# EAGLE schematic MAIN BOARD fat outline (EAGLE 5.11)
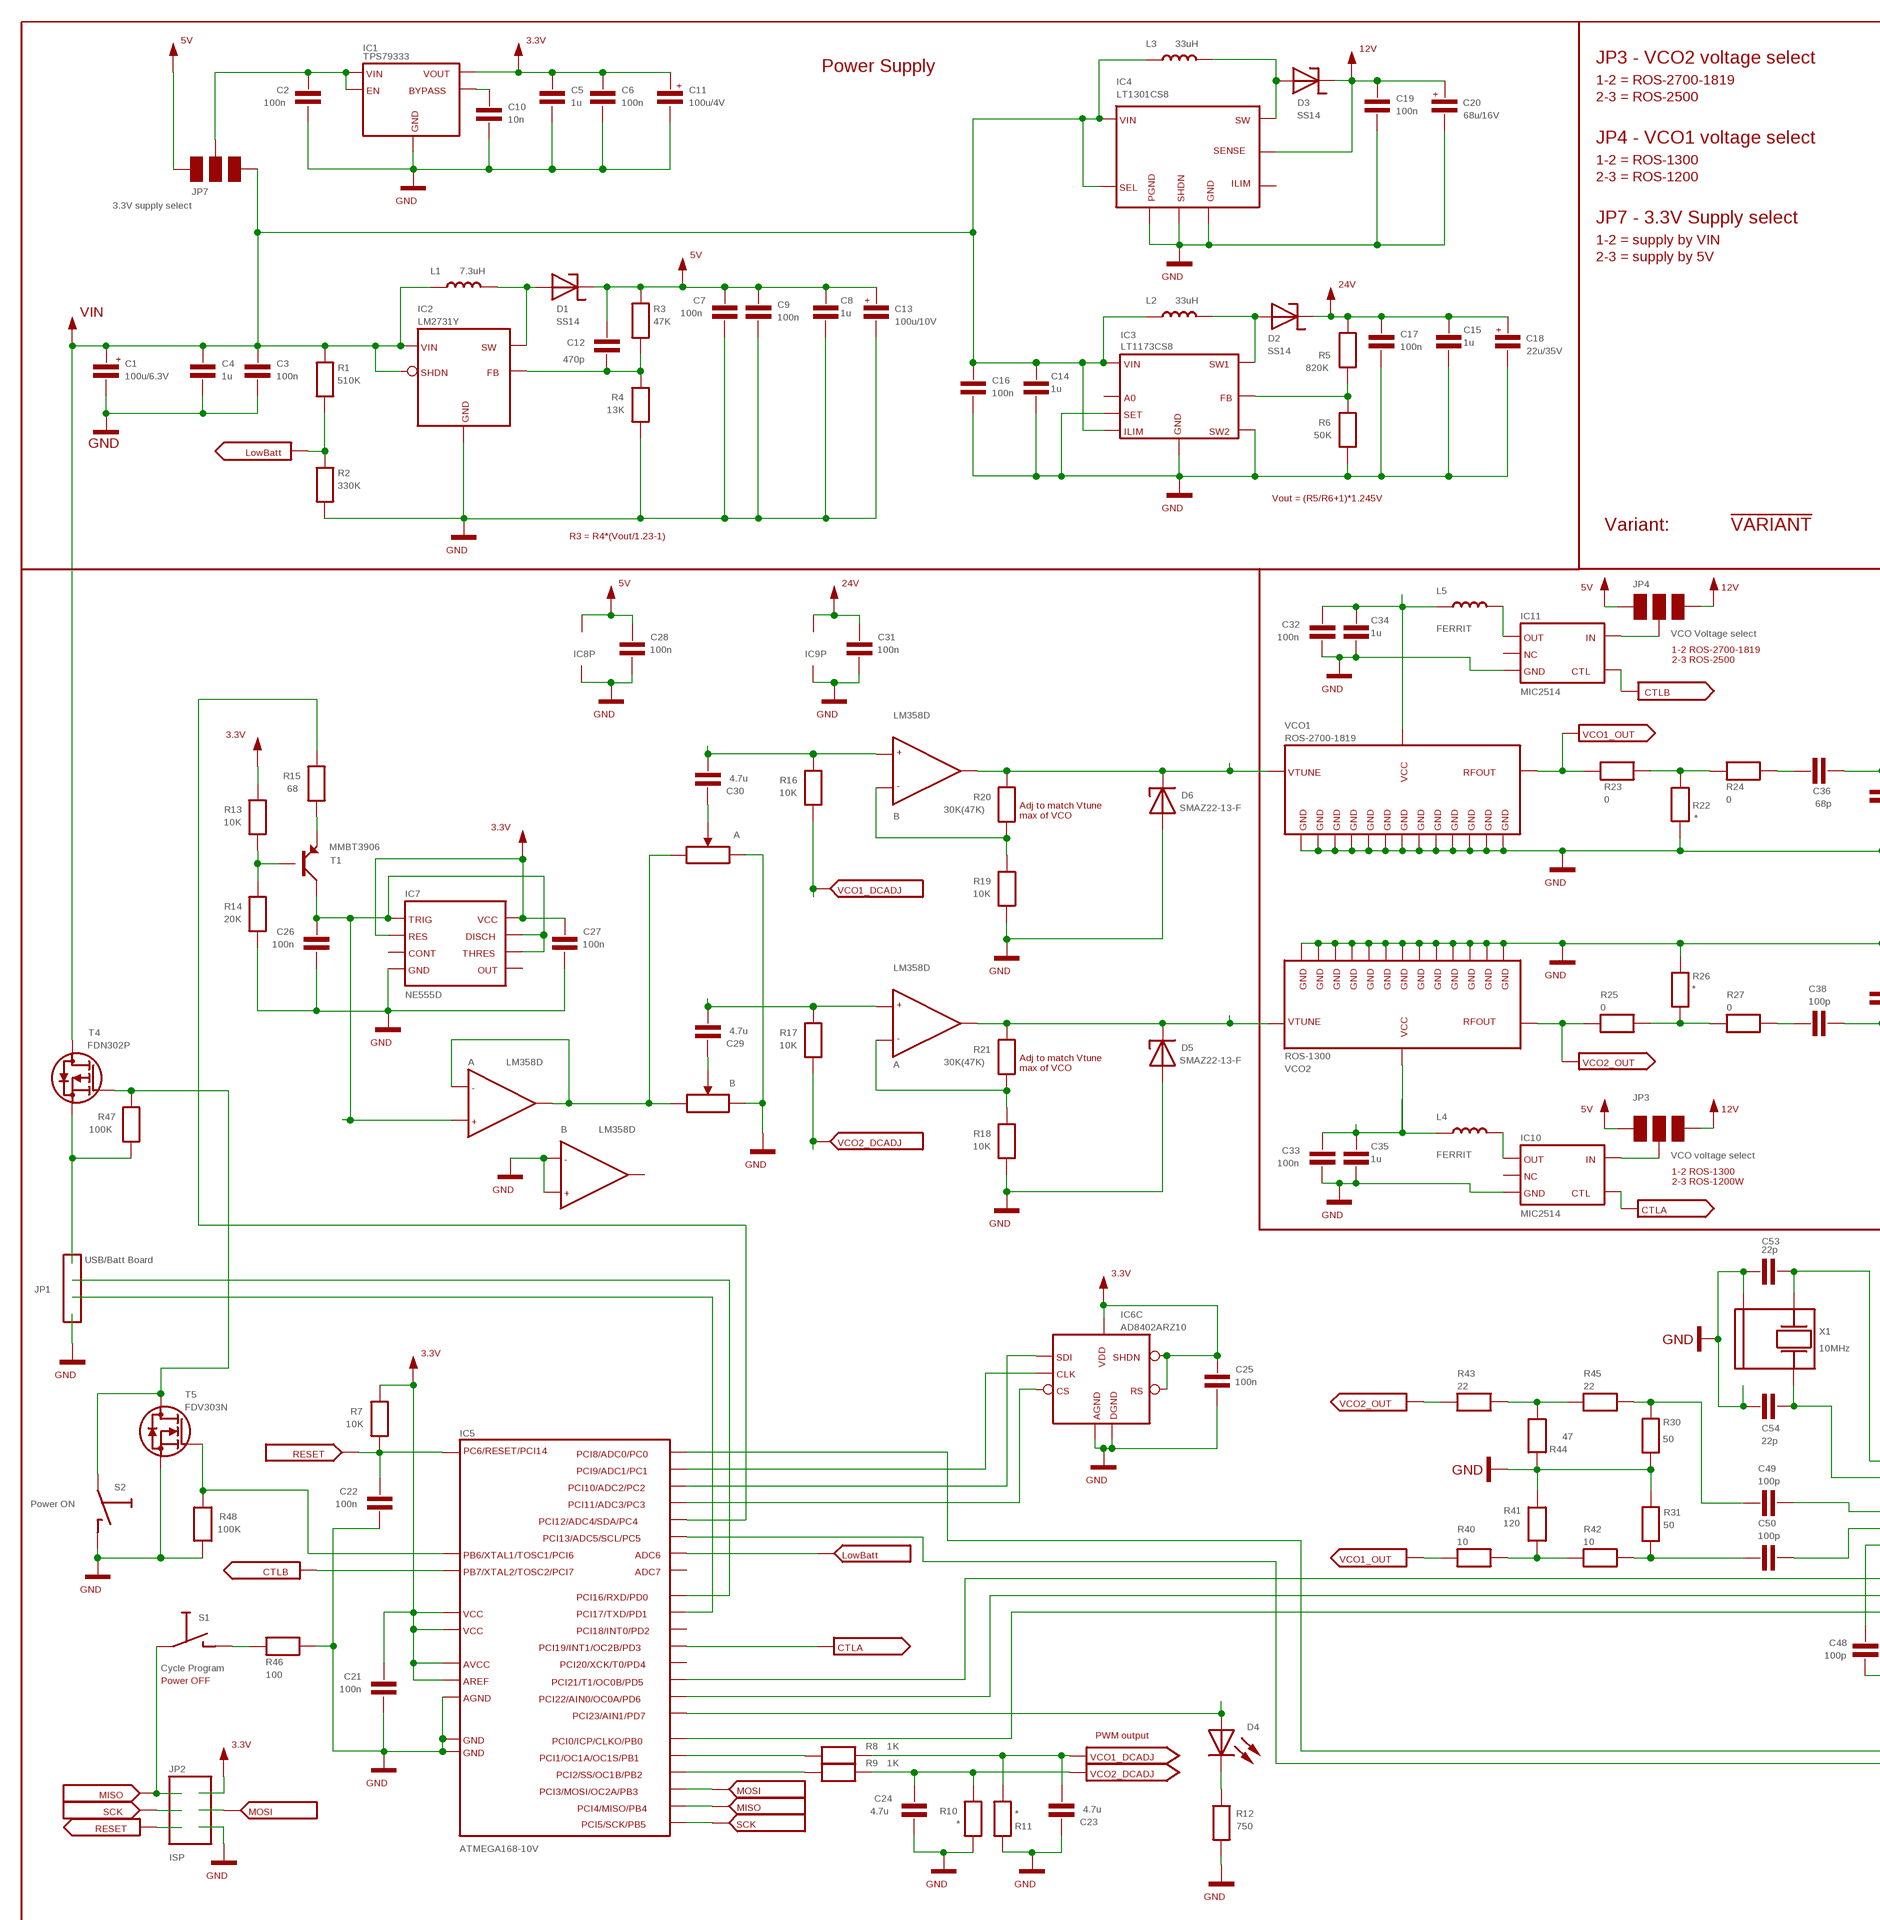
[diagram p0: schematic, sheet 1, part 1 of 2]
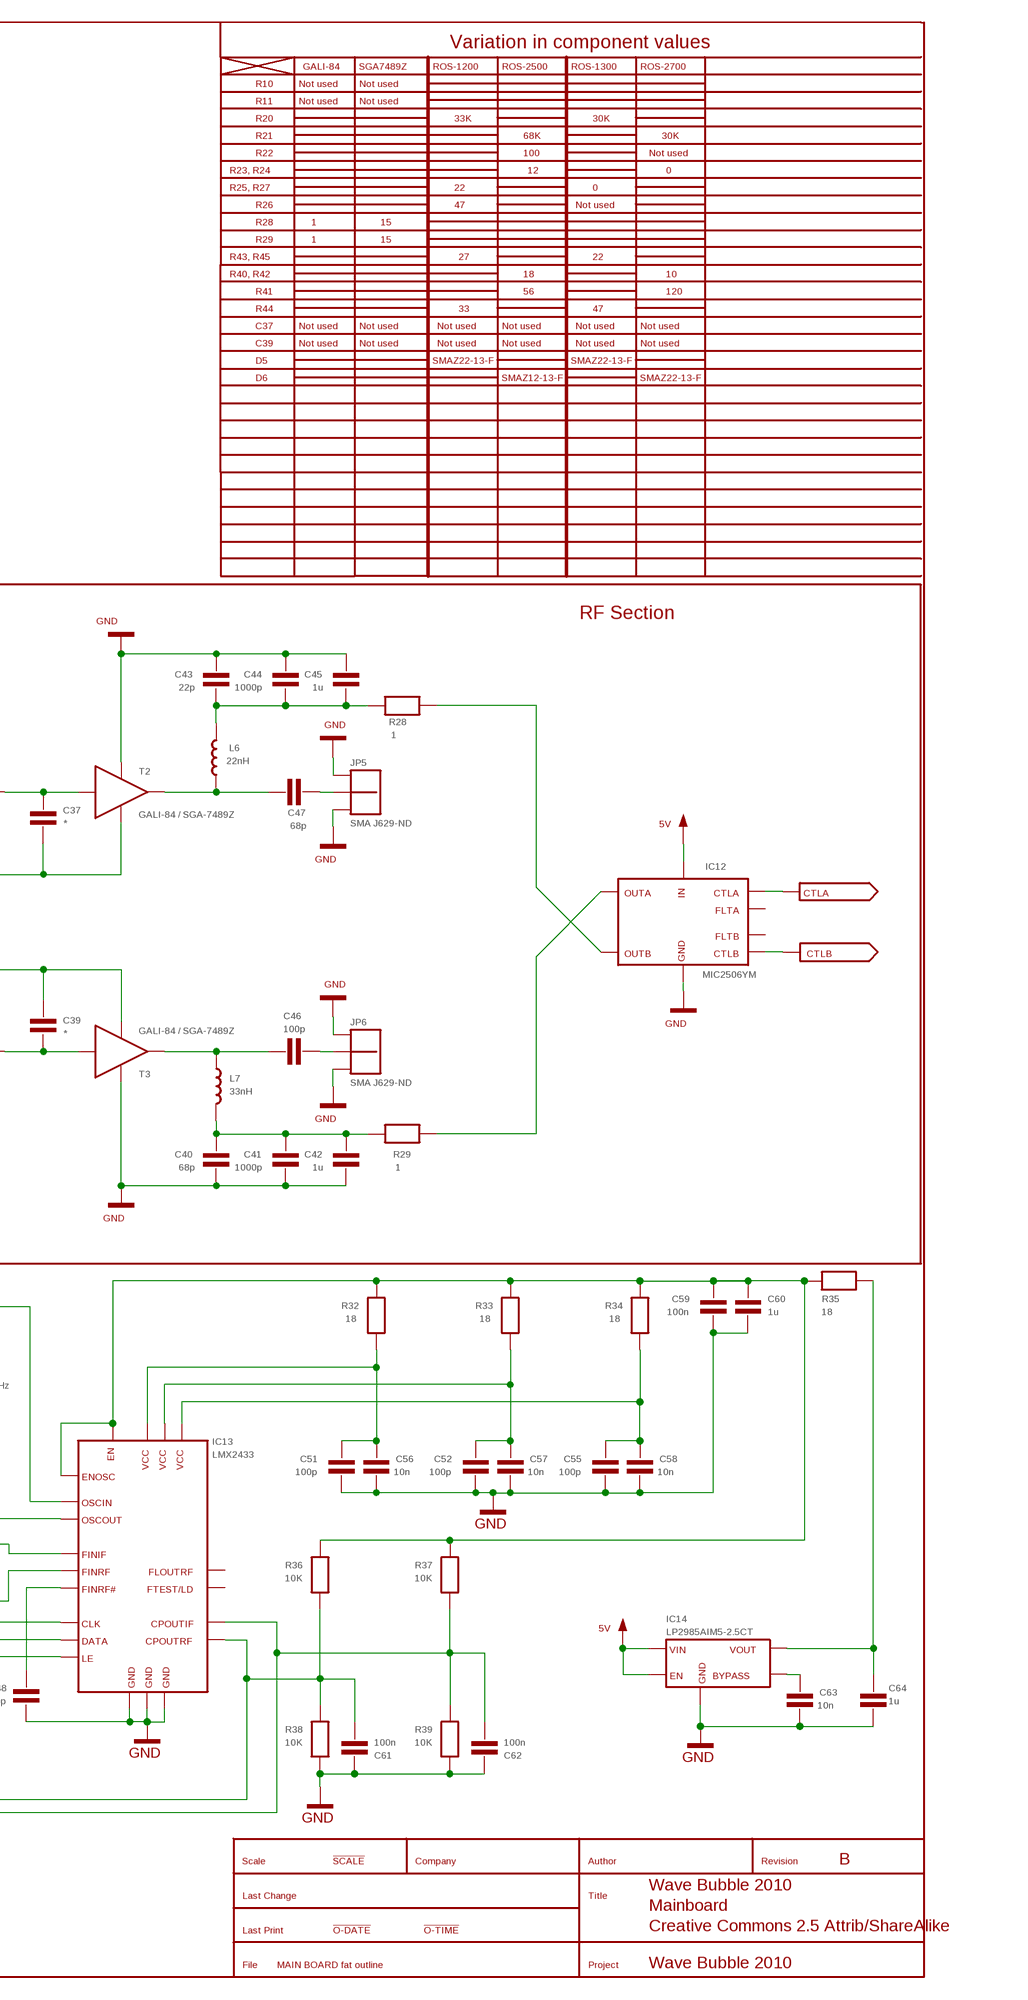
[diagram p1: schematic, sheet 1, part 2 of 2]

## Parts
C1  100u/6.3V  C1  [C1]
C2  100n  C2  [C2]
C3  100n  C3  [C3]
C4  1u  C4  [C4]
C5  1u  C5  [C5]
C6  100n  C6  [C6]
C7  100n  C7  [C7]
C8  1u  C8  [C8]
C9  100n  C9  [C9]
C10  10n  C10  [C10]
C11  100u/4V  C11  [C11]
C12  470p  C12  [C12]
C13  100u/10V  C13  [C13]
C14  1u  C14  [C14]
C15  1u  C15  [C15]
C16  100n  C16  [C16]
C17  100n  C17  [C17]
C18  22u/35V  C18  [C18]
C19  100n  C19  [C19]
C20  68u/16V  C20  [C20]
C21  100n  C21  [C21]
C22  100n  C22  [C22]
C23  4.7u  C23  [C23]
C24  4.7u  C24  [C24]
C25  100n  C25  [C25]
C26  100n  C26  [C26]
C27  100n  C27  [C27]
C28  100n  C28  [C28]
C29  4.7u  C29  [C29]
C30  4.7u  C30  [C30]
C31  100n  C31  [C31]
C32  100n  C32  [C32]
C33  100n  C33  [C33]
C34  1u  C34  [C34]
C35  1u  C35  [C35]
C36  68p  C36  [C36]
C37  *  C37  [C37]
C38  100p  C38  [C38]
C39  *  C39  [C39]
C40  68p  C40  [C40]
C41  1000p  C41  [C41]
C42  1u  C42  [C42]
C43  22p  C43  [C43]
C44  1000p  C44  [C44]
C45  1u  C45  [C45]
C46  100p  C46  [C46]
C47  68p  C47  [C47]
C48  100p  C48  [C48]
C49  100p  C49  [C49]
C50  100p  C50  [C50]
C51  100p  C51  [C51]
C52  100p  C52  [C52]
C53  22p  C53  [C53]
C54  22p  C54  [C54]
C55  100p  C55  [C55]
C56  10n  C56  [C56]
C57  10n  C57  [C57]
C58  10n  C58  [C58]
C59  100n  C59  [C59]
C60  1u  C60  [C60]
C61  100n  C61  [C61]
C62  100n  C62  [C62]
C63  10n  C63  [C63]
C64  1u  C64  [C64]
D1  SS14  D1  [D1]
D2  SS14  D2  [D2]
D3  SS14  D3  [D3]
D4  GREEN  D4  [D4]
D5  SMAZ22-13-F  D5  [D5]
D6  SMAZ22-13-F  D6  [D6]
IC1  TPS79333  IC1  [IC1]
IC2  LM2731Y  IC2  [IC2]
IC3  LT1173CS8  IC3  [IC3]
IC4  LT1301CS8  IC4  [IC4]
IC5  ATMEGA168-10V  IC5  [IC5]
IC6  AD8402ARZ10  IC6  [IC6]
IC7  NE555D  IC7  [IC7]
IC8  LM358D  IC8  [IC8]
IC9  LM358D  IC9  [IC9]
IC10  MIC2514  IC10  [IC10]
IC11  MIC2514  IC11  [IC11]
IC12  MIC2506YM  IC12  [IC12]
IC13  LMX2433  IC13  [IC13]
IC14  LP2985AIM5-2.5CT  IC14  [IC14]
JP1  USB/Batt Board  JP1  [JP1]
JP2  ISP  JP2  [JP2]
JP3  VCO voltage select  JP3  [JP3]
JP4  VCO Voltage select  JP4  [JP4]
JP5  SMA J629-ND  JP5  [JP5]
JP6  SMA J629-ND  JP6  [JP6]
JP7  3.3V supply select  JP7  [JP7]
L1  7.3uH  L1  [L1]
L2  33uH  L2  [L2]
L3  33uH  L3  [L3]
L4  FERRIT  L4  [L4]
L5  FERRIT  L5  [L5]
L6  22nH  L6  [L6]
L7  33nH  L7  [L7]
R1  510K  R1  [R1]
R2  330K  R2  [R2]
R3  47K  R3  [R3]
R4  13K  R4  [R4]
R5  820K  R5  [R5]
R6  50K  R6  [R6]
R7  10K  R7  [R7]
R8  1K  R8  [R8]
R9  1K  R9  [R9]
R10  *  R10  [R10]
R11  *  R11  [R11]
R12  750  R12  [R12]
R13  10K  R13  [R13]
R14  20K  R14  [R14]
R15  68  R15  [R15]
R16  10K  R16  [R16]
R17  10K  R17  [R17]
R18  10K  R18  [R18]
R19  10K  R19  [R19]
R20  30K(47K)  R20  [R20]
R21  30K(47K)  R21  [R21]
R22  *  R22  [R22]
R23  0  R23  [R23]
R24  0  R24  [R24]
R25  0  R25  [R25]
R26  *  R26  [R26]
R27  0  R27  [R27]
R28  1  R28  [R28]
R29  1  R29  [R29]
R30  50  R30  [R30]
R31  50  R31  [R31]
R32  18  R32  [R32]
R33  18  R33  [R33]
R34  18  R34  [R34]
R35  18  R35  [R35]
R36  10K  R36  [R36]
R37  10K  R37  [R37]
R38  10K  R38  [R38]
R39  10K  R39  [R39]
R40  10  R40  [R40]
R41  120  R41  [R41]
R42  10  R42  [R42]
R43  22  R43  [R43]
R44  47  R44  [R44]
R45  22  R45  [R45]
R46  100  R46  [R46]
R47  100K  R47  [R47]
R48  100K  R48  [R48]
S1  Cycle Program  S1  [S1]
S2  Power ON  S2  [S2]
T1  MMBT3906  T1  [T1]
T2  GALI-84 / SGA-7489Z  T2  [T2]
T3  GALI-84 / SGA-7489Z  T3  [T3]
T4  FDN302P  T4  [T4]
T5  FDV303N  T5  [T5]
VCO1  ROS-2700-1819  VCO1  [VCO1]
VCO2  ROS-1300  VCO2  [VCO2]
X1  10MHz  X1  [X1]

## Nets
1: JP1.1 R47.2 T4.2(S)
2: D1.1(A) IC2.1(SW) L1.2
3: IC5.31(PCI17/TXD/PD1) JP1.3
3.3V: C5.1 C6.1 C11.1(+) C21.1 C25.1 C27.1 IC1.5(VOUT) IC5.4(VCC) IC5.6(VCC) IC5.18(AVCC) IC5.20(AREF) IC6.6(C:SHDN) IC6.10(C:RS) IC6.11(C:VDD) IC7.4(RES) IC7.8(VCC) JP2.2 R7.1 R13.1 ; supply symbol labelled !VCC
5V: C7.1 C8.1 C9.1 C12.1 C13.1(+) C28.1 D1.2(K) IC8.8(P:V+) IC12.7(IN) IC14.1(VIN) IC14.3(EN) JP3.1 JP4.1 JP7.3 R3.1 ; supply symbol labelled !VCC
12V: C19.1 C20.1(+) D3.2(K) IC4.4(SENSE) JP3.3 JP4.3 ; supply symbol labelled !VCC
24V: C15.1 C17.1 C18.1(+) C31.1 D2.2(K) IC9.8(P:V+) R5.1 ; supply symbol labelled !VCC
+: C30.2 IC9.5(B:+) R16.1
BYPASS: C10.1 IC1.4(BYPASS)
CLK: IC5.24(PCI9/ADC1/PC1) IC6.9(C:CLK)
CPOUTRF: C61.1 IC5.23(PCI8/ADC0/PC0) IC13.13(CPOUTRF) R36.2 R38.1
CS: IC5.26(PCI11/ADC3/PC3) IC6.7(C:CS)
CTLA: IC5.1(PCI19/INT1/OC2B/PD3) IC10.1(CTL) IC12.1(CTLA) ; supply symbol labelled !SIG-AUS
CTLB: IC5.8(PB7/XTAL2/TOSC2/PCI7) IC11.1(CTL) IC12.4(CTLB) ; supply symbol labelled !SIG-AUS
DATA: IC5.10(PCI22/AIN0/OC0A/PD6) IC13.20(DATA)
FB: C12.2 IC2.3(FB) R3.2 R4.1
FINRF#: C48.2 IC13.16(FINRF#)
G: R47.1 S2.1 T4.1(G) T5.3(D)
GND: C1.2(-) C2.2 C3.2 C4.2 C5.2 C6.2 C7.2 C8.2 C9.2 C10.2 C11.2(-) C13.2(-) C14.2 C15.2 C16.2 C17.2 C18.2(-) C19.2 C20.2(-) C21.2 C22.2 C23.1 C24.2 C25.2 C26.2 C27.2 C28.2 C31.2 C32.2 C33.2 C34.2 C35.2 C37.2 C39.2 C40.1 C41.1 C42.1 C43.2 C44.2 C45.2 C48.1 C51.1 C52.1 C53.2 C54.1 C55.1 C56.1 C57.1 C58.1 C59.1 C60.1 C61.2 C62.2 C63.1 C64.2 D5.1(A) D6.1(A) IC1.2(GND) IC2.2(GND) IC3.4(SW2) IC3.5(GND) IC3.7(SET) IC4.1(GND) IC4.3(SHDN) IC4.8(PGND) IC5.3(GND) IC5.5(GND) IC5.21(AGND) IC6.1(C:AGND) IC6.2(A:B2) IC6.5(C:DGND) IC6.14(B:B1) IC7.1(GND) IC8.4(P:POW) IC8.5(B:+) IC8.6(B:-) IC9.4(P:POW) IC10.2(GND) IC11.2(GND) IC12.6(GND) IC13.2(GND) IC13.12(GND) IC13.14(GND) IC14.2(GND) JP1.4 JP2.6 JP5.1(PIN1) JP5.3(PIN3) JP6.1(PIN1) JP6.3(PIN3) R2.2 R4.2 R6.2 R10.2 R11.1 R12.1 R14.2 R18.2 R19.2 R22.2 R26.2 R30.2 R31.2 R38.2 R39.2 R41.2 R44.2 R46.2 R48.2 S2.2 T2.2(PIN2) T2.4(PIN4) T3.2(PIN2) T3.4(PIN4) T5.2(S) VCO1.1(GND) VCO1.3(GND) VCO1.4(GND) VCO1.5(GND) VCO1.6(GND) VCO1.7(GND) VCO1.8(GND) VCO1.9(GND) VCO1.11(GND) VCO1.12(GND) VCO1.13(GND) VCO1.15(GND) VCO1.16(GND) VCO2.1(GND) VCO2.3(GND) VCO2.4(GND) VCO2.5(GND) VCO2.6(GND) VCO2.7(GND) VCO2.8(GND) VCO2.9(GND) VCO2.11(GND) VCO2.12(GND) VCO2.13(GND) VCO2.15(GND) VCO2.16(GND) X1.4 ; supply symbol labelled !GND
IN: IC10.3(IN) JP3.2
LE: IC5.12(PCI0/ICP/CLKO/PB0) IC13.18(LE)
LOWBATT: IC5.19(ADC6) R1.2 R2.1 ; supply symbol labelled !SIG-AUS, !SIG-EIN
MISO: IC5.16(PCI4/MISO/PB4) JP2.1 S1.1 ; supply symbol labelled !SIG-EIN
MOSI: IC5.15(PCI3/MOSI/OC2A/PB3) JP2.4 ; supply symbol labelled !SIG-EIN
OSCIN: C53.1 IC13.8(OSCIN) X1.1
OUT: IC6.3(A:A2) IC6.13(B:A1) IC8.1(A:OUT) IC8.2(A:-)
OUTA: IC12.8(OUTA) R29.2
OUTB: IC12.5(OUTB) R28.2
PCI12/ADC4/SDA/PC4: IC5.27(PCI12/ADC4/SDA/PC4) R15.1
PCI13/ADC5/SCL/PC5: C62.1 IC5.28(PCI13/ADC5/SCL/PC5) IC13.5(CPOUTIF) R37.2 R39.1
PCI23/AIN1/PD7: D4.1(A) IC5.11(PCI23/AIN1/PD7)
PIN3: C47.1 L6.1 T2.3(PIN3)
RESET: C22.1 IC5.29(PC6/RESET/PCI14) JP2.5 R7.2 ; supply symbol labelled !SIG-EIN, !SIG-AUS
SCK: IC5.17(PCI5/SCK/PB5) JP2.3 ; supply symbol labelled !SIG-EIN
SDI: IC5.25(PCI10/ADC2/PC2) IC6.8(C:SDI)
SIG$8: IC3.8(FB) R5.2 R6.1
SIG$18: IC5.13(PCI1/OC1A/OC1S/PB1) R8.1
SIG$19: IC5.14(PCI2/SS/OC1B/PB2) R9.1
SIG$20: D4.2(K) R12.2
SIG$22: IC5.30(PCI16/RXD/PD0) JP1.2
SIG$30: R13.2 R14.1 T1.1(B)
SIG$31: R15.2 T1.2(E)
SIG$34: C30.1 IC6.4(A:W2)
SIG$35: C29.1 IC6.12(B:W1)
SIG$37: C29.2 IC9.3(A:+) R17.1
SIG$39: IC9.6(B:-) R19.1 R20.2
SIG$40: IC9.2(A:-) R18.1 R21.2
SIG$41: D5.2(K) IC9.1(A:OUT) R21.1 VCO2.2(VTUNE)
SIG$42: D6.2(K) IC9.7(B:OUT) R20.1 VCO1.2(VTUNE)
SIG$44: C32.1 C34.1 L5.1 VCO1.14(VCC)
SIG$45: IC11.4(OUT) L5.2
SIG$46: IC10.4(OUT) L4.2
SIG$48: IC11.3(IN) JP4.2
SIG$51: C38.2 C39.1 T3.1(PIN1)
SIG$52: C36.2 C37.1 T2.1(PIN1)
SIG$55: C46.1 L7.1 T3.3(PIN3)
SIG$56: C40.2 C41.2 C42.2 L7.2 R29.1
SIG$57: C43.1 C44.1 C45.1 L6.2 R28.1
SIG$62: IC5.9(PCI21/T1/OC0B/PD5) IC13.19(CLK)
SIG$65: C49.2 IC13.3(FINIF)
SIG$66: C50.2 IC13.15(FINRF)
SIG$69: C51.2 C56.2 IC13.1(VCC) R32.2
SIG$70: C52.2 C57.2 IC13.9(VCC) R33.2
SIG$71: C55.2 C58.2 IC13.17(VCC) R34.2
SIG$72: C59.2 C60.2 IC13.4(EN) IC13.6(ENOSC) R32.1 R33.1 R34.1 R35.1 R36.1 R37.1
SIG$73: C63.2 IC14.4(BYPASS)
SIG$76: C47.2 JP5.2(PIN2)
SIG$77: C46.2 JP6.2(PIN2)
SIG$78: C54.2 IC13.7(OSCOUT) X1.3
SIG$79: C2.1 IC1.1(VIN) IC1.3(EN) JP7.2
SIG$80: R22.1 R23.2 R24.1
SIG$81: R25.1 R26.1 R27.2
SIG$82: C36.1 R24.2
SIG$83: R43.1 R44.1 R45.2
SIG$84: C49.1 R30.1 R45.1
SIG$85: R40.1 R41.1 R42.2
SIG$86: C50.1 R31.1 R42.1
SIG$87: C38.1 R27.1
SIG$88: R46.1 S1.2
SIG$90: IC5.7(PB6/XTAL1/TOSC1/PCI6) R48.1 T5.1(G)
SW: D3.1(A) IC4.7(SW) L3.2
SW1: D2.1(A) IC3.3(SW1) L2.2
TRIG: C26.1 IC7.2(TRIG) IC7.6(THRES) IC7.7(DISCH) IC8.3(A:+) T1.3(C)
VCC: C33.1 C35.1 L4.1 VCO2.14(VCC)
VCO1_DCADJ: C23.2 R8.2 R11.2 R16.2 ; supply symbol labelled !SIG-AUS, !SIG-EIN
VCO1_OUT: R23.1 R40.2 VCO1.10(RFOUT) ; supply symbol labelled !SIG-AUS
VCO2_DCADJ: C24.1 R9.2 R10.1 R17.2 ; supply symbol labelled !SIG-AUS, !SIG-EIN
VCO2_OUT: R25.2 R43.2 VCO2.10(RFOUT) ; supply symbol labelled !SIG-AUS
VIN: C1.1(+) C3.1 C4.1 C14.1 C16.1 IC2.4(SHDN) IC2.5(VIN) IC3.1(ILIM) IC3.2(VIN) IC4.2(SEL) IC4.6(VIN) JP7.1 L1.1 L2.1 L3.1 R1.1 T4.3(D) ; supply symbol labelled !VCC
VOUT: C64.1 IC14.5(VOUT) R35.2
Unconnected: IC3.6(A0) IC4.5(ILIM) IC5.2(PCI20/XCK/T0/PD4) IC5.22(ADC7) IC5.32(PCI18/INT0/PD2) IC7.3(OUT) IC7.5(CONT) IC8.7(B:OUT) IC10.5(NC) IC11.5(NC) IC12.2(FLTA) IC12.3(FLTB) IC13.10(FTEST/LD) IC13.11(FLOUTRF)

## Notes on the sheet
- Variation in component values
- JP3 - VCO2 voltage select
- GALI-84 | SGA7489Z | ROS-1200 | ROS-2500 | ROS-1300 | ROS-2700
- Power Supply
- 1-2 = ROS-2700-1819 | R10 | Not used | Not used
- 2-3 = ROS-2500 | R11 | Not used | Not used
- R20 | 33K | 30K
- R21 | 68K | 30K
- JP4 - VCO1 voltage select
- R22 | 100 | Not used
- 1-2 = ROS-1300
- R23, R24 | 12 | 0
- 2-3 = ROS-1200
- R25, R27 | 22 | 0
- R26 | 47 | Not used
- R28 | 1 | 15
- JP7 - 3.3V Supply select
- R29 | 1 | 15
- 1-2 = supply by VIN
- R43, R45 | 27 | 22
- 2-3 = supply by 5V
- R40, R42 | 18 | 10
- R41 | 56 | 120
- R44 | 33 | 47
- C37 | Not used | Not used | Not used | Not used | Not used | Not used
- C39 | Not used | Not used | Not used | Not used | Not used | Not used
- D5 | SMAZ22-13-F | SMAZ22-13-F
- D6 | SMAZ12-13-F | SMAZ22-13-F
- Vout = (R5/R6+1)*1.245V
- Variant: | !VARIANT
- R3 = R4*(Vout/1.23-1)
- RF Section
- 1-2 ROS-2700-1819
- 2-3 ROS-2500
- Adj to match Vtune
- max of VCO
- Adj to match Vtune
- max of VCO
- 1-2 ROS-1300
- 2-3 ROS-1200W
- Power OFF
- PWM output
- B
- Wave Bubble 2010
- Mainboard
- Creative Commons 2.5 Attrib/ShareAlike
- Wave Bubble 2010

## Library data of the parts
C1 = wave_bubble-main_new_Power_Switch_v2:C1: SMD ELKO 100 UF 6.3 V Miniatur SMD-Elektrolyt-Kondensatoren Sehr kleine Abm., für allgemeine Anwendung. Polaritätskennzeichnung (-) erfolgt durch einen Strich. Temperaturbereich: -40 bis +85 °C. Toleranz ±20%. µF/Volt 100/6,3 ; Durchmesser x H mm 6,3 x 6,
C2 = wave_bubble-main_new_Power_Switch_v2:C2: SMD VS KONDENSATOR 0.1 UF 1206 50 V SMD-Vielschicht-Keramik-Kondensatoren Nennspannung 50 V - 1 pF - 1000 pF NPO; 1200 pF -1 µF X7R. Toleranz 1 pF ... 1000 pF: 5%; 1200 pF ... 1 µF: ±10%. Baugröße 1206 ; Wert 0,1 µ
C3 = wave_bubble-main_new_Power_Switch_v2:C3: SMD VS KONDENSATOR 0.1 UF 1206 50 V SMD-Vielschicht-Keramik-Kondensatoren Nennspannung 50 V - 1 pF - 1000 pF NPO; 1200 pF -1 µF X7R. Toleranz 1 pF ... 1000 pF: 5%; 1200 pF ... 1 µF: ±10%. Baugröße 1206 ; Wert 0,1 µ
C4 = wave_bubble-main_new_Power_Switch_v2:C4: SMD VS KONDENSATOR 0.1 UF 1206 50 V SMD-Vielschicht-Keramik-Kondensatoren Nennspannung 50 V - 1 pF - 1000 pF NPO; 1200 pF -1 µF X7R. Toleranz 1 pF ... 1000 pF: 5%; 1200 pF ... 1 µF: ±10%. Baugröße 1206 ; Wert 0,1 µ
C5 = wave_bubble-main_new_Power_Switch_v2:C5: SMD VS KONDENSATOR 0.1 UF 1206 50 V SMD-Vielschicht-Keramik-Kondensatoren Nennspannung 50 V - 1 pF - 1000 pF NPO; 1200 pF -1 µF X7R. Toleranz 1 pF ... 1000 pF: 5%; 1200 pF ... 1 µF: ±10%. Baugröße 1206 ; Wert 0,1 µ
C6 = wave_bubble-main_new_Power_Switch_v2:C6: SMD VS KONDENSATOR 0.1 UF 1206 50 V SMD-Vielschicht-Keramik-Kondensatoren Nennspannung 50 V - 1 pF - 1000 pF NPO; 1200 pF -1 µF X7R. Toleranz 1 pF ... 1000 pF: 5%; 1200 pF ... 1 µF: ±10%. Baugröße 1206 ; Wert 0,1 µ
C7 = wave_bubble-main_new_Power_Switch_v2:C7: SMD VS KONDENSATOR 0.1 UF 1206 50 V SMD-Vielschicht-Keramik-Kondensatoren Nennspannung 50 V - 1 pF - 1000 pF NPO; 1200 pF -1 µF X7R. Toleranz 1 pF ... 1000 pF: 5%; 1200 pF ... 1 µF: ±10%. Baugröße 1206 ; Wert 0,1 µ
C8 = wave_bubble-main_new_Power_Switch_v2:C8: SMD VS KONDENSATOR 0.1 UF 1206 50 V SMD-Vielschicht-Keramik-Kondensatoren Nennspannung 50 V - 1 pF - 1000 pF NPO; 1200 pF -1 µF X7R. Toleranz 1 pF ... 1000 pF: 5%; 1200 pF ... 1 µF: ±10%. Baugröße 1206 ; Wert 0,1 µ
C9 = wave_bubble-main_new_Power_Switch_v2:C9: SMD VS KONDENSATOR 0.1 UF 1206 50 V SMD-Vielschicht-Keramik-Kondensatoren Nennspannung 50 V - 1 pF - 1000 pF NPO; 1200 pF -1 µF X7R. Toleranz 1 pF ... 1000 pF: 5%; 1200 pF ... 1 µF: ±10%. Baugröße 1206 ; Wert 0,1 µ
C10 = wave_bubble-main_new_Power_Switch_v2:C10: SMD VS KONDENSATOR 0.1 UF 1206 50 V SMD-Vielschicht-Keramik-Kondensatoren Nennspannung 50 V - 1 pF - 1000 pF NPO; 1200 pF -1 µF X7R. Toleranz 1 pF ... 1000 pF: 5%; 1200 pF ... 1 µF: ±10%. Baugröße 1206 ; Wert 0,1 µ
C11 = wave_bubble-main_new_Power_Switch_v2:C11: SMD ELKO 100 UF 6.3 V Miniatur SMD-Elektrolyt-Kondensatoren Sehr kleine Abm., für allgemeine Anwendung. Polaritätskennzeichnung (-) erfolgt durch einen Strich. Temperaturbereich: -40 bis +85 °C. Toleranz ±20%. µF/Volt 100/6,3 ; Durchmesser x H mm 6,3 x 6,
C12 = wave_bubble-main_new_Power_Switch_v2:C12: SMD VS KONDENSATOR 0.1 UF 1206 50 V SMD-Vielschicht-Keramik-Kondensatoren Nennspannung 50 V - 1 pF - 1000 pF NPO; 1200 pF -1 µF X7R. Toleranz 1 pF ... 1000 pF: 5%; 1200 pF ... 1 µF: ±10%. Baugröße 1206 ; Wert 0,1 µ
C13 = wave_bubble-main_new_Power_Switch_v2:C13: SMD ELKO TANTAL KONDENSATOR 100 UF 10% Kapazitätstoleranz bei allen Elektrolyt-Kondensatoren ±10% CN µF 100 ; UN bis 85°C V- 16 ; Baugröße E ; Typ B45196-H3107-K50
C14 = wave_bubble-main_new_Power_Switch_v2:C14: SMD VS KONDENSATOR 0.1 UF 1206 50 V SMD-Vielschicht-Keramik-Kondensatoren Nennspannung 50 V - 1 pF - 1000 pF NPO; 1200 pF -1 µF X7R. Toleranz 1 pF ... 1000 pF: 5%; 1200 pF ... 1 µF: ±10%. Baugröße 1206 ; Wert 0,1 µ
C15 = wave_bubble-main_new_Power_Switch_v2:C15: SMD VS KONDENSATOR 0.1 UF 1206 50 V SMD-Vielschicht-Keramik-Kondensatoren Nennspannung 50 V - 1 pF - 1000 pF NPO; 1200 pF -1 µF X7R. Toleranz 1 pF ... 1000 pF: 5%; 1200 pF ... 1 µF: ±10%. Baugröße 1206 ; Wert 0,1 µ
C16 = wave_bubble-main_new_Power_Switch_v2:C16: SMD VS KONDENSATOR 0.1 UF 1206 50 V SMD-Vielschicht-Keramik-Kondensatoren Nennspannung 50 V - 1 pF - 1000 pF NPO; 1200 pF -1 µF X7R. Toleranz 1 pF ... 1000 pF: 5%; 1200 pF ... 1 µF: ±10%. Baugröße 1206 ; Wert 0,1 µ
C17 = wave_bubble-main_new_Power_Switch_v2:C17: SMD VS KONDENSATOR 0.1 UF 1206 50 V SMD-Vielschicht-Keramik-Kondensatoren Nennspannung 50 V - 1 pF - 1000 pF NPO; 1200 pF -1 µF X7R. Toleranz 1 pF ... 1000 pF: 5%; 1200 pF ... 1 µF: ±10%. Baugröße 1206 ; Wert 0,1 µ
C18 = wave_bubble-main_new_Power_Switch_v2:C18: SMD ELKO TANTAL KONDENSATOR 100 UF 10% Kapazitätstoleranz bei allen Elektrolyt-Kondensatoren ±10% CN µF 100 ; UN bis 85°C V- 16 ; Baugröße E ; Typ B45196-H3107-K50
C19 = wave_bubble-main_new_Power_Switch_v2:C19: SMD VS KONDENSATOR 0.1 UF 1206 50 V SMD-Vielschicht-Keramik-Kondensatoren Nennspannung 50 V - 1 pF - 1000 pF NPO; 1200 pF -1 µF X7R. Toleranz 1 pF ... 1000 pF: 5%; 1200 pF ... 1 µF: ±10%. Baugröße 1206 ; Wert 0,1 µ
C20 = wave_bubble-main_new_Power_Switch_v2:C20: SMD ELKO TANTAL KONDENSATOR 100 UF 10% Kapazitätstoleranz bei allen Elektrolyt-Kondensatoren ±10% CN µF 100 ; UN bis 85°C V- 16 ; Baugröße E ; Typ B45196-H3107-K50
C21 = wave_bubble-main_new_Power_Switch_v2:C21: SMD VS KONDENSATOR 0.1 UF 1206 50 V SMD-Vielschicht-Keramik-Kondensatoren Nennspannung 50 V - 1 pF - 1000 pF NPO; 1200 pF -1 µF X7R. Toleranz 1 pF ... 1000 pF: 5%; 1200 pF ... 1 µF: ±10%. Baugröße 1206 ; Wert 0,1 µ
C22 = wave_bubble-main_new_Power_Switch_v2:C22: SMD VS KONDENSATOR 0.1 UF 1206 50 V SMD-Vielschicht-Keramik-Kondensatoren Nennspannung 50 V - 1 pF - 1000 pF NPO; 1200 pF -1 µF X7R. Toleranz 1 pF ... 1000 pF: 5%; 1200 pF ... 1 µF: ±10%. Baugröße 1206 ; Wert 0,1 µ
C23 = wave_bubble-main_new_Power_Switch_v2:C23: SMD VS KONDENSATOR 0.1 UF 1206 50 V SMD-Vielschicht-Keramik-Kondensatoren Nennspannung 50 V - 1 pF - 1000 pF NPO; 1200 pF -1 µF X7R. Toleranz 1 pF ... 1000 pF: 5%; 1200 pF ... 1 µF: ±10%. Baugröße 1206 ; Wert 0,1 µ
C24 = wave_bubble-main_new_Power_Switch_v2:C24: SMD VS KONDENSATOR 0.1 UF 1206 50 V SMD-Vielschicht-Keramik-Kondensatoren Nennspannung 50 V - 1 pF - 1000 pF NPO; 1200 pF -1 µF X7R. Toleranz 1 pF ... 1000 pF: 5%; 1200 pF ... 1 µF: ±10%. Baugröße 1206 ; Wert 0,1 µ
C25 = wave_bubble-main_new_Power_Switch_v2:C25: SMD VS KONDENSATOR 0.1 UF 1206 50 V SMD-Vielschicht-Keramik-Kondensatoren Nennspannung 50 V - 1 pF - 1000 pF NPO; 1200 pF -1 µF X7R. Toleranz 1 pF ... 1000 pF: 5%; 1200 pF ... 1 µF: ±10%. Baugröße 1206 ; Wert 0,1 µ
C26 = wave_bubble-main_new_Power_Switch_v2:C26: SMD VS KONDENSATOR 0.1 UF 1206 50 V SMD-Vielschicht-Keramik-Kondensatoren Nennspannung 50 V - 1 pF - 1000 pF NPO; 1200 pF -1 µF X7R. Toleranz 1 pF ... 1000 pF: 5%; 1200 pF ... 1 µF: ±10%. Baugröße 1206 ; Wert 0,1 µ
C27 = wave_bubble-main_new_Power_Switch_v2:C27: SMD VS KONDENSATOR 0.1 UF 1206 50 V SMD-Vielschicht-Keramik-Kondensatoren Nennspannung 50 V - 1 pF - 1000 pF NPO; 1200 pF -1 µF X7R. Toleranz 1 pF ... 1000 pF: 5%; 1200 pF ... 1 µF: ±10%. Baugröße 1206 ; Wert 0,1 µ
C28 = wave_bubble-main_new_Power_Switch_v2:C28: SMD VS KONDENSATOR 0.1 UF 1206 50 V SMD-Vielschicht-Keramik-Kondensatoren Nennspannung 50 V - 1 pF - 1000 pF NPO; 1200 pF -1 µF X7R. Toleranz 1 pF ... 1000 pF: 5%; 1200 pF ... 1 µF: ±10%. Baugröße 1206 ; Wert 0,1 µ
C29 = wave_bubble-main_new_Power_Switch_v2:C29: SMD VS KONDENSATOR 0.1 UF 1206 50 V SMD-Vielschicht-Keramik-Kondensatoren Nennspannung 50 V - 1 pF - 1000 pF NPO; 1200 pF -1 µF X7R. Toleranz 1 pF ... 1000 pF: 5%; 1200 pF ... 1 µF: ±10%. Baugröße 1206 ; Wert 0,1 µ
C30 = wave_bubble-main_new_Power_Switch_v2:C30: SMD VS KONDENSATOR 0.1 UF 1206 50 V SMD-Vielschicht-Keramik-Kondensatoren Nennspannung 50 V - 1 pF - 1000 pF NPO; 1200 pF -1 µF X7R. Toleranz 1 pF ... 1000 pF: 5%; 1200 pF ... 1 µF: ±10%. Baugröße 1206 ; Wert 0,1 µ
C31 = wave_bubble-main_new_Power_Switch_v2:C31: SMD VS KONDENSATOR 0.1 UF 1206 50 V SMD-Vielschicht-Keramik-Kondensatoren Nennspannung 50 V - 1 pF - 1000 pF NPO; 1200 pF -1 µF X7R. Toleranz 1 pF ... 1000 pF: 5%; 1200 pF ... 1 µF: ±10%. Baugröße 1206 ; Wert 0,1 µ
C32 = wave_bubble-main_new_Power_Switch_v2:C32: SMD VS KONDENSATOR 0.1 UF 1206 50 V SMD-Vielschicht-Keramik-Kondensatoren Nennspannung 50 V - 1 pF - 1000 pF NPO; 1200 pF -1 µF X7R. Toleranz 1 pF ... 1000 pF: 5%; 1200 pF ... 1 µF: ±10%. Baugröße 1206 ; Wert 0,1 µ
C33 = wave_bubble-main_new_Power_Switch_v2:C33: SMD VS KONDENSATOR 0.1 UF 1206 50 V SMD-Vielschicht-Keramik-Kondensatoren Nennspannung 50 V - 1 pF - 1000 pF NPO; 1200 pF -1 µF X7R. Toleranz 1 pF ... 1000 pF: 5%; 1200 pF ... 1 µF: ±10%. Baugröße 1206 ; Wert 0,1 µ
C34 = wave_bubble-main_new_Power_Switch_v2:C34: SMD VS KONDENSATOR 0.1 UF 1206 50 V SMD-Vielschicht-Keramik-Kondensatoren Nennspannung 50 V - 1 pF - 1000 pF NPO; 1200 pF -1 µF X7R. Toleranz 1 pF ... 1000 pF: 5%; 1200 pF ... 1 µF: ±10%. Baugröße 1206 ; Wert 0,1 µ
C35 = wave_bubble-main_new_Power_Switch_v2:C35: SMD VS KONDENSATOR 0.1 UF 1206 50 V SMD-Vielschicht-Keramik-Kondensatoren Nennspannung 50 V - 1 pF - 1000 pF NPO; 1200 pF -1 µF X7R. Toleranz 1 pF ... 1000 pF: 5%; 1200 pF ... 1 µF: ±10%. Baugröße 1206 ; Wert 0,1 µ
C36 = wave_bubble-main_new_Power_Switch_v2:C36: SMD VS KONDENSATOR 0.1 UF 1206 50 V SMD-Vielschicht-Keramik-Kondensatoren Nennspannung 50 V - 1 pF - 1000 pF NPO; 1200 pF -1 µF X7R. Toleranz 1 pF ... 1000 pF: 5%; 1200 pF ... 1 µF: ±10%. Baugröße 1206 ; Wert 0,1 µ
C37 = wave_bubble-main_new_Power_Switch_v2:C37: SMD VS KONDENSATOR 0.1 UF 1206 50 V SMD-Vielschicht-Keramik-Kondensatoren Nennspannung 50 V - 1 pF - 1000 pF NPO; 1200 pF -1 µF X7R. Toleranz 1 pF ... 1000 pF: 5%; 1200 pF ... 1 µF: ±10%. Baugröße 1206 ; Wert 0,1 µ
C38 = wave_bubble-main_new_Power_Switch_v2:C38: SMD VS KONDENSATOR 0.1 UF 1206 50 V SMD-Vielschicht-Keramik-Kondensatoren Nennspannung 50 V - 1 pF - 1000 pF NPO; 1200 pF -1 µF X7R. Toleranz 1 pF ... 1000 pF: 5%; 1200 pF ... 1 µF: ±10%. Baugröße 1206 ; Wert 0,1 µ
C39 = wave_bubble-main_new_Power_Switch_v2:C39: SMD VS KONDENSATOR 0.1 UF 1206 50 V SMD-Vielschicht-Keramik-Kondensatoren Nennspannung 50 V - 1 pF - 1000 pF NPO; 1200 pF -1 µF X7R. Toleranz 1 pF ... 1000 pF: 5%; 1200 pF ... 1 µF: ±10%. Baugröße 1206 ; Wert 0,1 µ
C40 = wave_bubble-main_new_Power_Switch_v2:C40: SMD VS KONDENSATOR 0.1 UF 1206 50 V SMD-Vielschicht-Keramik-Kondensatoren Nennspannung 50 V - 1 pF - 1000 pF NPO; 1200 pF -1 µF X7R. Toleranz 1 pF ... 1000 pF: 5%; 1200 pF ... 1 µF: ±10%. Baugröße 1206 ; Wert 0,1 µ
C41 = wave_bubble-main_new_Power_Switch_v2:C41: SMD VS KONDENSATOR 0.1 UF 1206 50 V SMD-Vielschicht-Keramik-Kondensatoren Nennspannung 50 V - 1 pF - 1000 pF NPO; 1200 pF -1 µF X7R. Toleranz 1 pF ... 1000 pF: 5%; 1200 pF ... 1 µF: ±10%. Baugröße 1206 ; Wert 0,1 µ
C42 = wave_bubble-main_new_Power_Switch_v2:C42: SMD VS KONDENSATOR 0.1 UF 1206 50 V SMD-Vielschicht-Keramik-Kondensatoren Nennspannung 50 V - 1 pF - 1000 pF NPO; 1200 pF -1 µF X7R. Toleranz 1 pF ... 1000 pF: 5%; 1200 pF ... 1 µF: ±10%. Baugröße 1206 ; Wert 0,1 µ
C43 = wave_bubble-main_new_Power_Switch_v2:C43: SMD VS KONDENSATOR 0.1 UF 1206 50 V SMD-Vielschicht-Keramik-Kondensatoren Nennspannung 50 V - 1 pF - 1000 pF NPO; 1200 pF -1 µF X7R. Toleranz 1 pF ... 1000 pF: 5%; 1200 pF ... 1 µF: ±10%. Baugröße 1206 ; Wert 0,1 µ
C44 = wave_bubble-main_new_Power_Switch_v2:C44: SMD VS KONDENSATOR 0.1 UF 1206 50 V SMD-Vielschicht-Keramik-Kondensatoren Nennspannung 50 V - 1 pF - 1000 pF NPO; 1200 pF -1 µF X7R. Toleranz 1 pF ... 1000 pF: 5%; 1200 pF ... 1 µF: ±10%. Baugröße 1206 ; Wert 0,1 µ
C45 = wave_bubble-main_new_Power_Switch_v2:C45: SMD VS KONDENSATOR 0.1 UF 1206 50 V SMD-Vielschicht-Keramik-Kondensatoren Nennspannung 50 V - 1 pF - 1000 pF NPO; 1200 pF -1 µF X7R. Toleranz 1 pF ... 1000 pF: 5%; 1200 pF ... 1 µF: ±10%. Baugröße 1206 ; Wert 0,1 µ
C46 = wave_bubble-main_new_Power_Switch_v2:C46: SMD VS KONDENSATOR 0.1 UF 1206 50 V SMD-Vielschicht-Keramik-Kondensatoren Nennspannung 50 V - 1 pF - 1000 pF NPO; 1200 pF -1 µF X7R. Toleranz 1 pF ... 1000 pF: 5%; 1200 pF ... 1 µF: ±10%. Baugröße 1206 ; Wert 0,1 µ
C47 = wave_bubble-main_new_Power_Switch_v2:C47: SMD VS KONDENSATOR 0.1 UF 1206 50 V SMD-Vielschicht-Keramik-Kondensatoren Nennspannung 50 V - 1 pF - 1000 pF NPO; 1200 pF -1 µF X7R. Toleranz 1 pF ... 1000 pF: 5%; 1200 pF ... 1 µF: ±10%. Baugröße 1206 ; Wert 0,1 µ
C48 = wave_bubble-main_new_Power_Switch_v2:C48: SMD VS KONDENSATOR 0.1 UF 1206 50 V SMD-Vielschicht-Keramik-Kondensatoren Nennspannung 50 V - 1 pF - 1000 pF NPO; 1200 pF -1 µF X7R. Toleranz 1 pF ... 1000 pF: 5%; 1200 pF ... 1 µF: ±10%. Baugröße 1206 ; Wert 0,1 µ
C49 = wave_bubble-main_new_Power_Switch_v2:C49: SMD VS KONDENSATOR 0.1 UF 1206 50 V SMD-Vielschicht-Keramik-Kondensatoren Nennspannung 50 V - 1 pF - 1000 pF NPO; 1200 pF -1 µF X7R. Toleranz 1 pF ... 1000 pF: 5%; 1200 pF ... 1 µF: ±10%. Baugröße 1206 ; Wert 0,1 µ
C50 = wave_bubble-main_new_Power_Switch_v2:C50: SMD VS KONDENSATOR 0.1 UF 1206 50 V SMD-Vielschicht-Keramik-Kondensatoren Nennspannung 50 V - 1 pF - 1000 pF NPO; 1200 pF -1 µF X7R. Toleranz 1 pF ... 1000 pF: 5%; 1200 pF ... 1 µF: ±10%. Baugröße 1206 ; Wert 0,1 µ
C51 = wave_bubble-main_new_Power_Switch_v2:C51: SMD VS KONDENSATOR 0.1 UF 1206 50 V SMD-Vielschicht-Keramik-Kondensatoren Nennspannung 50 V - 1 pF - 1000 pF NPO; 1200 pF -1 µF X7R. Toleranz 1 pF ... 1000 pF: 5%; 1200 pF ... 1 µF: ±10%. Baugröße 1206 ; Wert 0,1 µ
C52 = wave_bubble-main_new_Power_Switch_v2:C52: SMD VS KONDENSATOR 0.1 UF 1206 50 V SMD-Vielschicht-Keramik-Kondensatoren Nennspannung 50 V - 1 pF - 1000 pF NPO; 1200 pF -1 µF X7R. Toleranz 1 pF ... 1000 pF: 5%; 1200 pF ... 1 µF: ±10%. Baugröße 1206 ; Wert 0,1 µ
C53 = wave_bubble-main_new_Power_Switch_v2:C53: SMD VS KONDENSATOR 0.1 UF 1206 50 V SMD-Vielschicht-Keramik-Kondensatoren Nennspannung 50 V - 1 pF - 1000 pF NPO; 1200 pF -1 µF X7R. Toleranz 1 pF ... 1000 pF: 5%; 1200 pF ... 1 µF: ±10%. Baugröße 1206 ; Wert 0,1 µ
C54 = wave_bubble-main_new_Power_Switch_v2:C54: SMD VS KONDENSATOR 0.1 UF 1206 50 V SMD-Vielschicht-Keramik-Kondensatoren Nennspannung 50 V - 1 pF - 1000 pF NPO; 1200 pF -1 µF X7R. Toleranz 1 pF ... 1000 pF: 5%; 1200 pF ... 1 µF: ±10%. Baugröße 1206 ; Wert 0,1 µ
C55 = wave_bubble-main_new_Power_Switch_v2:C55: SMD VS KONDENSATOR 0.1 UF 1206 50 V SMD-Vielschicht-Keramik-Kondensatoren Nennspannung 50 V - 1 pF - 1000 pF NPO; 1200 pF -1 µF X7R. Toleranz 1 pF ... 1000 pF: 5%; 1200 pF ... 1 µF: ±10%. Baugröße 1206 ; Wert 0,1 µ
C56 = wave_bubble-main_new_Power_Switch_v2:C56: SMD VS KONDENSATOR 0.1 UF 1206 50 V SMD-Vielschicht-Keramik-Kondensatoren Nennspannung 50 V - 1 pF - 1000 pF NPO; 1200 pF -1 µF X7R. Toleranz 1 pF ... 1000 pF: 5%; 1200 pF ... 1 µF: ±10%. Baugröße 1206 ; Wert 0,1 µ
C57 = wave_bubble-main_new_Power_Switch_v2:C57: SMD VS KONDENSATOR 0.1 UF 1206 50 V SMD-Vielschicht-Keramik-Kondensatoren Nennspannung 50 V - 1 pF - 1000 pF NPO; 1200 pF -1 µF X7R. Toleranz 1 pF ... 1000 pF: 5%; 1200 pF ... 1 µF: ±10%. Baugröße 1206 ; Wert 0,1 µ
C58 = wave_bubble-main_new_Power_Switch_v2:C58: SMD VS KONDENSATOR 0.1 UF 1206 50 V SMD-Vielschicht-Keramik-Kondensatoren Nennspannung 50 V - 1 pF - 1000 pF NPO; 1200 pF -1 µF X7R. Toleranz 1 pF ... 1000 pF: 5%; 1200 pF ... 1 µF: ±10%. Baugröße 1206 ; Wert 0,1 µ
C59 = wave_bubble-main_new_Power_Switch_v2:C59: SMD VS KONDENSATOR 0.1 UF 1206 50 V SMD-Vielschicht-Keramik-Kondensatoren Nennspannung 50 V - 1 pF - 1000 pF NPO; 1200 pF -1 µF X7R. Toleranz 1 pF ... 1000 pF: 5%; 1200 pF ... 1 µF: ±10%. Baugröße 1206 ; Wert 0,1 µ
C60 = wave_bubble-main_new_Power_Switch_v2:C60: SMD VS KONDENSATOR 0.1 UF 1206 50 V SMD-Vielschicht-Keramik-Kondensatoren Nennspannung 50 V - 1 pF - 1000 pF NPO; 1200 pF -1 µF X7R. Toleranz 1 pF ... 1000 pF: 5%; 1200 pF ... 1 µF: ±10%. Baugröße 1206 ; Wert 0,1 µ
C61 = wave_bubble-main_new_Power_Switch_v2:C61: SMD VS KONDENSATOR 0.1 UF 1206 50 V SMD-Vielschicht-Keramik-Kondensatoren Nennspannung 50 V - 1 pF - 1000 pF NPO; 1200 pF -1 µF X7R. Toleranz 1 pF ... 1000 pF: 5%; 1200 pF ... 1 µF: ±10%. Baugröße 1206 ; Wert 0,1 µ
C62 = wave_bubble-main_new_Power_Switch_v2:C62: SMD VS KONDENSATOR 0.1 UF 1206 50 V SMD-Vielschicht-Keramik-Kondensatoren Nennspannung 50 V - 1 pF - 1000 pF NPO; 1200 pF -1 µF X7R. Toleranz 1 pF ... 1000 pF: 5%; 1200 pF ... 1 µF: ±10%. Baugröße 1206 ; Wert 0,1 µ
C63 = wave_bubble-main_new_Power_Switch_v2:C63: SMD VS KONDENSATOR 0.1 UF 1206 50 V SMD-Vielschicht-Keramik-Kondensatoren Nennspannung 50 V - 1 pF - 1000 pF NPO; 1200 pF -1 µF X7R. Toleranz 1 pF ... 1000 pF: 5%; 1200 pF ... 1 µF: ±10%. Baugröße 1206 ; Wert 0,1 µ
C64 = wave_bubble-main_new_Power_Switch_v2:C64: SMD VS KONDENSATOR 0.1 UF 1206 50 V SMD-Vielschicht-Keramik-Kondensatoren Nennspannung 50 V - 1 pF - 1000 pF NPO; 1200 pF -1 µF X7R. Toleranz 1 pF ... 1000 pF: 5%; 1200 pF ... 1 µF: ±10%. Baugröße 1206 ; Wert 0,1 µ
D1 = wave_bubble-main_new_Power_Switch_v2:D1: Diode Schottky
D2 = wave_bubble-main_new_Power_Switch_v2:D2: Diode Schottky
D3 = wave_bubble-main_new_Power_Switch_v2:D3: Diode Schottky
D4 = wave_bubble-main_new_Power_Switch_v2:D4: Leuchtdiode, SMD 1206, Diffus, grün
D5 = wave_bubble-main_new_Power_Switch_v2:D5: Diode Schottky
D6 = wave_bubble-main_new_Power_Switch_v2:D6: Diode Schottky
IC1 = wave_bubble-main_new_Power_Switch_v2:IC1
IC2 = wave_bubble-main_new_Power_Switch_v2:IC2
IC3 = wave_bubble-main_new_Power_Switch_v2:IC3: DC/DC Konverter-ICs, LT..., DC/DC-Wandler, LT 1173CS8 [SO8]
IC4 = wave_bubble-main_new_Power_Switch_v2:IC4: Aufwärts-Schaltregler IC (DIL8)
IC5 = wave_bubble-main_new_Power_Switch_v2:IC5: 8-bit AVR Microcontroller with 8K Bytes In.System Programmable Flash
IC6 = wave_bubble-main_new_Power_Switch_v2:IC6: Dualpoti 10K
IC7 = wave_bubble-main_new_Power_Switch_v2:IC7: Präzisions-Zeitgeber (Timer)
IC8 = wave_bubble-main_new_Power_Switch_v2:IC8: SMD 2x Universal-Operationsverstärker (8-SMD-1)
IC9 = wave_bubble-main_new_Power_Switch_v2:IC9: SMD 2x Universal-Operationsverstärker (8-SMD-1)
IC10 = wave_bubble-main_new_Power_Switch_v2:IC10
IC11 = wave_bubble-main_new_Power_Switch_v2:IC11
IC12 = wave_bubble-main_new_Power_Switch_v2:IC12
IC13 = wave_bubble-main_new_Power_Switch_v2:IC13
IC14 = wave_bubble-main_new_Power_Switch_v2:IC14
JP1 = wave_bubble-main_new_Power_Switch_v2:JP1: Buchsenleiste 4-polig RM2,54
JP2 = wave_bubble-main_new_Power_Switch_v2:JP2: Buchsenleiste 2x3-polig RM2,54
JP3 = wave_bubble-main_new_Power_Switch_v2:JP3: Lötjumper 3-fach, RM 1,27, offen
JP4 = wave_bubble-main_new_Power_Switch_v2:JP4: Lötjumper 3-fach, RM 1,27, offen
JP5 = wave_bubble-main_new_Power_Switch_v2:JP5
JP6 = wave_bubble-main_new_Power_Switch_v2:JP6
JP7 = wave_bubble-main_new_Power_Switch_v2:JP7: Lötjumper 3-fach, RM 1,27, offen
L1 = wave_bubble-main_new_Power_Switch_v2:L1: Miniatur-Festinduktivität 100µH
L2 = wave_bubble-main_new_Power_Switch_v2:L2: Miniatur-Festinduktivität 100µH
L3 = wave_bubble-main_new_Power_Switch_v2:L3: Miniatur-Festinduktivität 100µH
L4 = wave_bubble-main_new_Power_Switch_v2:L4: SMD-Ferrite, 0603/0805/1206/1806, Chip EMV Filter [0,3 A], 742 792 122
L5 = wave_bubble-main_new_Power_Switch_v2:L5: SMD-Ferrite, 0603/0805/1206/1806, Chip EMV Filter [0,3 A], 742 792 122
L6 = wave_bubble-main_new_Power_Switch_v2:L6: SMD-Ferrite, 0603/0805/1206/1806, Chip EMV Filter [0,3 A], 742 792 122
L7 = wave_bubble-main_new_Power_Switch_v2:L7: SMD-Ferrite, 0603/0805/1206/1806, Chip EMV Filter [0,3 A], 742 792 122
R1 = wave_bubble-main_new_Power_Switch_v2:R1: SMD-Widerstand 0-Ohm
R2 = wave_bubble-main_new_Power_Switch_v2:R2: SMD-Widerstand 0-Ohm
R3 = wave_bubble-main_new_Power_Switch_v2:R3: SMD-Widerstand 0-Ohm
R4 = wave_bubble-main_new_Power_Switch_v2:R4: SMD-Widerstand 0-Ohm
R5 = wave_bubble-main_new_Power_Switch_v2:R5: SMD-Widerstand 0-Ohm
R6 = wave_bubble-main_new_Power_Switch_v2:R6: SMD-Widerstand 0-Ohm
R7 = wave_bubble-main_new_Power_Switch_v2:R7: SMD-Widerstand 0-Ohm
R8 = wave_bubble-main_new_Power_Switch_v2:R8: SMD-Widerstand 0-Ohm
R9 = wave_bubble-main_new_Power_Switch_v2:R9: SMD-Widerstand 0-Ohm
R10 = wave_bubble-main_new_Power_Switch_v2:R10: SMD-Widerstand 0-Ohm
R11 = wave_bubble-main_new_Power_Switch_v2:R11: SMD-Widerstand 0-Ohm
R12 = wave_bubble-main_new_Power_Switch_v2:R12: SMD-Widerstand 0-Ohm
R13 = wave_bubble-main_new_Power_Switch_v2:R13: SMD-Widerstand 0-Ohm
R14 = wave_bubble-main_new_Power_Switch_v2:R14: SMD-Widerstand 0-Ohm
R15 = wave_bubble-main_new_Power_Switch_v2:R15: SMD-Widerstand 0-Ohm
R16 = wave_bubble-main_new_Power_Switch_v2:R16: SMD-Widerstand 0-Ohm
R17 = wave_bubble-main_new_Power_Switch_v2:R17: SMD-Widerstand 0-Ohm
R18 = wave_bubble-main_new_Power_Switch_v2:R18: SMD-Widerstand 0-Ohm
R19 = wave_bubble-main_new_Power_Switch_v2:R19: SMD-Widerstand 0-Ohm
R20 = wave_bubble-main_new_Power_Switch_v2:R20: SMD-Widerstand 0-Ohm
R21 = wave_bubble-main_new_Power_Switch_v2:R21: SMD-Widerstand 0-Ohm
R22 = wave_bubble-main_new_Power_Switch_v2:R22: SMD-Widerstand 0-Ohm
R23 = wave_bubble-main_new_Power_Switch_v2:R23: SMD-Widerstand 0-Ohm
R24 = wave_bubble-main_new_Power_Switch_v2:R24: SMD-Widerstand 0-Ohm
R25 = wave_bubble-main_new_Power_Switch_v2:R25: SMD-Widerstand 0-Ohm
R26 = wave_bubble-main_new_Power_Switch_v2:R26: SMD-Widerstand 0-Ohm
R27 = wave_bubble-main_new_Power_Switch_v2:R27: SMD-Widerstand 0-Ohm
R28 = wave_bubble-main_new_Power_Switch_v2:R28: SMD-Widerstand 0-Ohm
R29 = wave_bubble-main_new_Power_Switch_v2:R29: SMD-Widerstand 0-Ohm
R30 = wave_bubble-main_new_Power_Switch_v2:R30: SMD-Widerstand 0-Ohm
R31 = wave_bubble-main_new_Power_Switch_v2:R31: SMD-Widerstand 0-Ohm
R32 = wave_bubble-main_new_Power_Switch_v2:R32: SMD-Widerstand 0-Ohm
R33 = wave_bubble-main_new_Power_Switch_v2:R33: SMD-Widerstand 0-Ohm
R34 = wave_bubble-main_new_Power_Switch_v2:R34: SMD-Widerstand 0-Ohm
R35 = wave_bubble-main_new_Power_Switch_v2:R35: SMD-Widerstand 0-Ohm
R36 = wave_bubble-main_new_Power_Switch_v2:R36: SMD-Widerstand 0-Ohm
R37 = wave_bubble-main_new_Power_Switch_v2:R37: SMD-Widerstand 0-Ohm
R38 = wave_bubble-main_new_Power_Switch_v2:R38: SMD-Widerstand 0-Ohm
R39 = wave_bubble-main_new_Power_Switch_v2:R39: SMD-Widerstand 0-Ohm
R40 = wave_bubble-main_new_Power_Switch_v2:R40: SMD-Widerstand 0-Ohm
R41 = wave_bubble-main_new_Power_Switch_v2:R41: SMD-Widerstand 0-Ohm
R42 = wave_bubble-main_new_Power_Switch_v2:R42: SMD-Widerstand 0-Ohm
R43 = wave_bubble-main_new_Power_Switch_v2:R43: SMD-Widerstand 0-Ohm
R44 = wave_bubble-main_new_Power_Switch_v2:R44: SMD-Widerstand 0-Ohm
R45 = wave_bubble-main_new_Power_Switch_v2:R45: SMD-Widerstand 0-Ohm
R46 = wave_bubble-main_new_Power_Switch_v2:R46: SMD-Widerstand 0-Ohm
R47 = wave_bubble-main_new_Power_Switch_v2:R47: SMD-Widerstand 0-Ohm
R48 = wave_bubble-main_new_Power_Switch_v2:R48: SMD-Widerstand 0-Ohm
S1 = wave_bubble-main_new_Power_Switch_v2:S1: Standard Taster, Schließer
S2 = wave_bubble-main_new_Power_Switch_v2:S2: Standard Taster, Schließer
T1 = wave_bubble-main_new_Power_Switch_v2:T1: TRANSISTOR, PNP, SOT23 Transistor, Typ: Small Signal General Purpose; Wandlerpolarität: PNP; Gehäusetyp: SOT23; Spannung Uceo(V): 40V; Strom Ic max.: 200mA; Leistung Ptot: 350mW; hfe, min.: 100; Strom Ic (hfe): 10mA;
T2 = wave_bubble-main_new_Power_Switch_v2:T2
T3 = wave_bubble-main_new_Power_Switch_v2:T3
T4 = wave_bubble-main_new_Power_Switch_v2:T4: Single P-Channel, Logic Level, PowerTrench MOSFET
T5 = wave_bubble-main_new_Power_Switch_v2:T5: N-Channel 2.5V Specified PowerTrench MOSFET
VCO1 = wave_bubble-main_new_Power_Switch_v2:VCO1
VCO2 = wave_bubble-main_new_Power_Switch_v2:VCO2
X1 = wave_bubble-main_new_Power_Switch_v2:X1